# Altium schematic sheet Sheet2.SchDoc
size A4
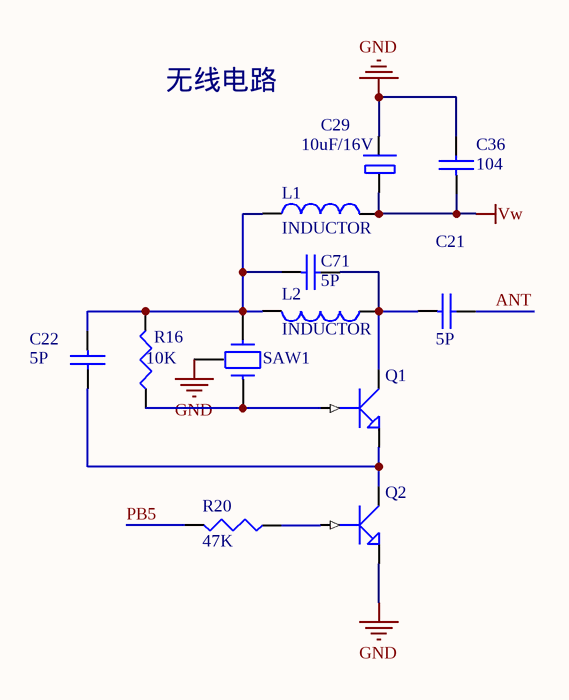
[diagram p0: Sheet2.SchDoc]

## Parts
C21  5P  [0603]
C22  5P  [0603]
C29  10uF/16V  [0805]
C36  104  [0603]
C71  5P  [0603]
L1  INDUCTOR  [4.5t]
L2  INDUCTOR  [4.5T]
Q1  NPN1  [SOT-23]  (value not drawn)
Q2  NPN1  [SOT-23]  (value not drawn)
R16  10K  [0603]
R20  47K  [0603]
SAW1  (no value)  [TO-39]

## Nets
GND: C29.2 C36.2 Q2.2(E) SAW1.3(GND)
Vw: C29.1 C36.1 L1.2
ANT: C21.2
PB5: R20.2
NetC21_1: C21.1 C71.2 L2.1 Q1.3(C)
NetC22_1: C22.1 C71.1 L1.1 L2.2 R16.2 SAW1.1
NetC22_2: C22.2 Q1.2(E) Q2.3(C)
NetQ1_1: Q1.1(B) R16.1 SAW1.2
NetQ2_1: Q2.1(B) R20.1

## Notes on the sheet
- 无线电路

## Library data of the parts
C21 C22 C36 C71 = CAP
C29 = C+
L1 L2 = INDUCTOR: 4.5T
Q1 = NPN1: 2SC3357
Q2 = NPN1: 3904
R16 R20 = RES1
SAW1 = CRYSTAL(表面接地)